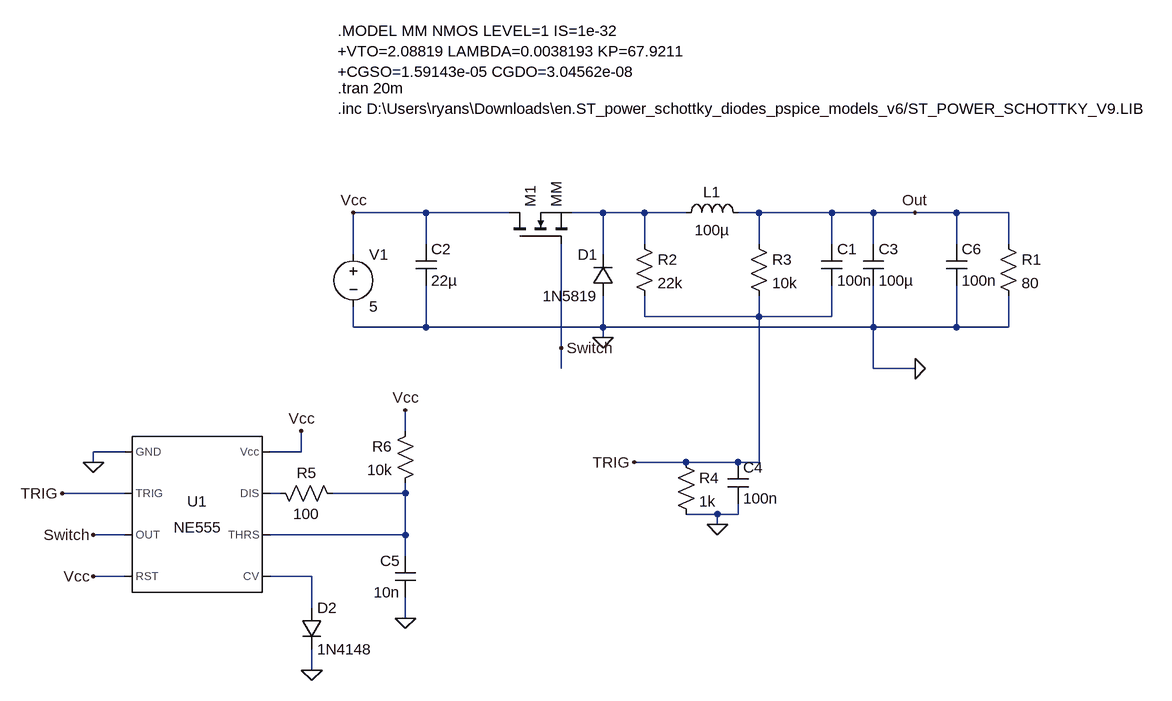
[diagram p0: schematic Class Example Buck.asc]
Class Example Buck.asc, the LTspice schematic file:
Version 4
SHEET 1 2292 1092
WIRE 368 64 256 64
WIRE 496 64 368 64
WIRE 640 64 592 64
WIRE 704 64 640 64
WIRE 768 64 704 64
WIRE 880 64 848 64
WIRE 992 64 880 64
WIRE 1056 64 992 64
WIRE 1120 64 1056 64
WIRE 1184 64 1120 64
WIRE 1264 64 1184 64
WIRE 368 112 368 64
WIRE 704 112 704 64
WIRE 880 112 880 64
WIRE 992 112 992 64
WIRE 1056 112 1056 64
WIRE 1184 112 1184 64
WIRE 1264 112 1264 64
WIRE 256 128 256 64
WIRE 640 128 640 64
WIRE 704 224 704 192
WIRE 880 224 880 192
WIRE 880 224 704 224
WIRE 992 224 992 176
WIRE 992 224 880 224
WIRE 256 240 256 208
WIRE 368 240 368 176
WIRE 368 240 256 240
WIRE 640 240 640 192
WIRE 640 240 368 240
WIRE 1056 240 1056 176
WIRE 1056 240 640 240
WIRE 1184 240 1184 176
WIRE 1184 240 1056 240
WIRE 1264 240 1264 192
WIRE 1264 240 1184 240
WIRE 640 256 640 240
WIRE 576 272 576 112
WIRE 576 304 576 272
WIRE 1056 304 1056 240
WIRE 1120 304 1056 304
WIRE 336 400 336 368
WIRE -96 432 -144 432
WIRE 176 432 176 400
WIRE 176 432 128 432
WIRE -144 448 -144 432
WIRE 768 448 688 448
WIRE 848 448 768 448
WIRE 880 448 880 224
WIRE 880 448 848 448
WIRE -96 496 -192 496
WIRE 144 496 128 496
WIRE 336 496 336 480
WIRE 336 496 224 496
WIRE 816 528 768 528
WIRE 848 528 848 512
WIRE 848 528 816 528
WIRE 816 544 816 528
WIRE -96 560 -144 560
WIRE 336 560 336 496
WIRE 336 560 128 560
WIRE 336 592 336 560
WIRE -96 624 -144 624
WIRE 192 624 128 624
WIRE 192 672 192 624
WIRE 336 688 336 656
WIRE 192 768 192 736
FLAG 640 256 0
FLAG 576 272 Switch
FLAG 1120 64 Out
FLAG 256 64 Vcc
FLAG 816 544 0
FLAG 176 400 Vcc
FLAG -144 560 Switch
FLAG -144 448 0
FLAG -144 624 Vcc
FLAG -192 496 TRIG
FLAG 688 448 TRIG
FLAG 192 768 0
FLAG 336 688 0
FLAG 336 368 Vcc
FLAG 1120 304 0
SYMBOL voltage 256 112 R0
WINDOW 123 0 0 Left 0
WINDOW 39 0 0 Left 0
SYMATTR InstName V1
SYMATTR Value 5
SYMBOL diode 656 192 R180
WINDOW 0 24 64 Left 2
WINDOW 3 24 0 Left 2
SYMATTR InstName D1
SYMATTR Value 1N5819
SYMBOL ind 752 80 R270
WINDOW 0 32 56 VTop 2
WINDOW 3 5 56 VBottom 2
SYMATTR InstName L1
SYMATTR Value 100µ
SYMBOL cap 976 112 R0
SYMATTR InstName C1
SYMATTR Value 100n
SYMBOL nmos 496 112 R270
SYMATTR InstName M1
SYMATTR Value MM
SYMBOL cap 352 112 R0
SYMATTR InstName C2
SYMATTR Value 22µ
SYMBOL res 688 96 R0
SYMATTR InstName R2
SYMATTR Value 22k
SYMBOL res 864 96 R0
SYMATTR InstName R3
SYMATTR Value 10k
SYMBOL cap 1040 112 R0
SYMATTR InstName C3
SYMATTR Value 100µ
SYMBOL cap 832 448 R0
SYMATTR InstName C4
SYMATTR Value 100n
SYMBOL res 752 432 R0
SYMATTR InstName R4
SYMATTR Value 1k
SYMBOL Misc\\NE555 16 528 R0
SYMATTR InstName U1
SYMBOL diode 176 672 R0
SYMATTR InstName D2
SYMATTR Value 1N4148
SYMBOL cap 352 592 M0
SYMATTR InstName C5
SYMATTR Value 10n
SYMBOL res 352 384 M0
SYMATTR InstName R6
SYMATTR Value 10k
SYMBOL res 240 512 M270
WINDOW 0 32 56 VTop 2
WINDOW 3 0 56 VBottom 2
SYMATTR InstName R5
SYMATTR Value 100
SYMBOL res 1248 96 R0
SYMATTR InstName R1
SYMATTR Value 80
SYMBOL cap 1168 112 R0
SYMATTR InstName C6
SYMATTR Value 100n
TEXT 232 -216 Left 2 !.MODEL MM NMOS LEVEL=1 IS=1e-32\n+VTO=2.08819 LAMBDA=0.0038193 KP=67.9211\n+CGSO=1.59143e-05 CGDO=3.04562e-08
TEXT 232 -96 Left 2 !.inc D:\\Users\\ryans\\Downloads\\en.ST_power_schottky_diodes_pspice_models_v6/ST_POWER_SCHOTTKY_V9.LIB
TEXT 232 -128 Left 2 !.tran 20m

The netlist it stands for:
* Class Example Buck.asc
V1 Vcc 0 5
D1 0 N001 1N5819
L1 N001 Out 100µ
C1 Out TRIG 100n
M1 Vcc Switch N001 N001 MM
C2 Vcc 0 22µ
R2 N001 TRIG 22k
R3 Out TRIG 10k
C3 Out 0 100µ
C4 TRIG 0 100n
R4 TRIG 0 1k
XU1 0 TRIG Switch Vcc N004 N003 N002 Vcc NE555  ; pins GND TRIG OUT RST CV THRS DIS Vcc
D2 N004 0 1N4148
C5 N003 0 10n
R6 Vcc N003 10k
R5 N003 N002 100
R1 Out 0 80
C6 Out 0 100n
.model D D
.lib standard.dio
.model NMOS NMOS
.model PMOS PMOS
.lib standard.mos
.MODEL MM NMOS LEVEL=1 IS=1e-32
+VTO=2.08819 LAMBDA=0.0038193 KP=67.9211
+CGSO=1.59143e-05 CGDO=3.04562e-08
.inc D:\Users\ryans\Downloads\en.ST_power_schottky_diodes_pspice_models_v6/ST_POWER_SCHOTTKY_V9.LIB
.tran 20m
.lib NE555.sub
.backanno
.end